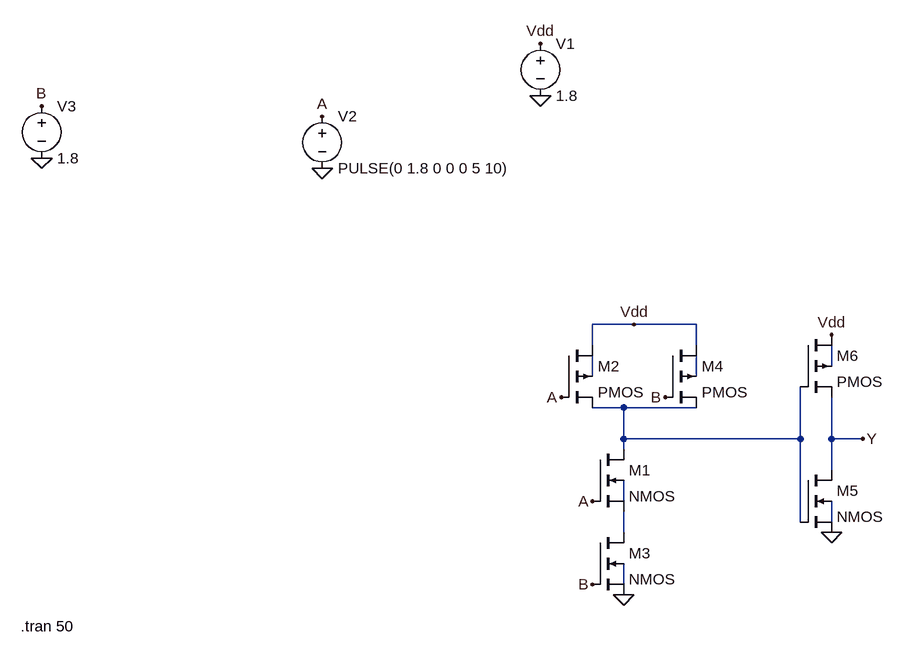
[diagram p0: schematic AND.asc]
AND.asc, the LTspice schematic file:
Version 4
SHEET 1 1584 896
WIRE 928 416 864 416
WIRE 1024 416 928 416
WIRE 864 448 864 416
WIRE 1024 448 1024 416
WIRE 1232 480 1232 448
WIRE 864 496 864 464
WIRE 1024 496 1024 464
WIRE 912 544 864 544
WIRE 1024 544 912 544
WIRE 912 592 912 544
WIRE 1184 592 1184 512
WIRE 1184 592 912 592
WIRE 1232 592 1232 528
WIRE 1280 592 1232 592
WIRE 912 608 912 592
WIRE 1232 640 1232 592
WIRE 912 688 912 656
WIRE 1184 720 1184 592
WIRE 1232 720 1232 688
WIRE 912 736 912 704
WIRE 912 816 912 784
FLAG 784 -16 Vdd
FLAG 784 64 0
FLAG 448 96 A
FLAG 448 176 0
FLAG 912 832 0
FLAG 928 416 Vdd
FLAG 16 80 B
FLAG 16 160 0
FLAG 816 528 A
FLAG 864 688 A
FLAG 976 528 B
FLAG 864 816 B
FLAG 1232 736 0
FLAG 1232 432 Vdd
FLAG 1280 592 Y
SYMBOL nmos4 864 608 R0
SYMATTR InstName M1
SYMATTR Value2 l=0.13u w=0.13u
SYMBOL pmos4 816 448 R0
SYMATTR InstName M2
SYMATTR Value2 l=0.13u w=0.13u
SYMBOL voltage 784 -32 R0
WINDOW 123 0 0 Left 0
WINDOW 39 0 0 Left 0
SYMATTR InstName V1
SYMATTR Value 1.8
SYMBOL voltage 448 80 R0
WINDOW 123 0 0 Left 0
WINDOW 39 0 0 Left 0
SYMATTR InstName V2
SYMATTR Value PULSE(0 1.8 0 0 0 5 10)
SYMBOL nmos4 864 736 R0
SYMATTR InstName M3
SYMATTR Value2 l=0.13u w=0.13u
SYMBOL pmos4 976 448 R0
SYMATTR InstName M4
SYMATTR Value2 l=0.13u w=0.13u
SYMBOL voltage 16 64 R0
WINDOW 123 0 0 Left 0
WINDOW 39 0 0 Left 0
SYMATTR InstName V3
SYMATTR Value 1.8
SYMBOL nmos4 1184 640 R0
SYMATTR InstName M5
SYMATTR Value2 l=0.13u w=0.13u
SYMBOL pmos4 1184 432 R0
SYMATTR InstName M6
SYMATTR Value2 l=0.13u w=0.13u
TEXT -16 880 Left 2 !.tran 50

The netlist it stands for:
* AND.asc
M1 N004 A N007 N005 NMOS l=0.13u w=0.13u
M2 Vdd A N004 N002 PMOS l=0.13u w=0.13u
V1 Vdd 0 1.8
V2 A 0 PULSE(0 1.8 0 0 0 5 10)
M3 N007 B 0 N008 NMOS l=0.13u w=0.13u
M4 Vdd B N004 N003 PMOS l=0.13u w=0.13u
V3 B 0 1.8
M5 Y N004 0 N006 NMOS l=0.13u w=0.13u
M6 Vdd N004 Y N001 PMOS l=0.13u w=0.13u
.model NMOS NMOS
.model PMOS PMOS
.lib standard.mos
.tran 50
.backanno
.end